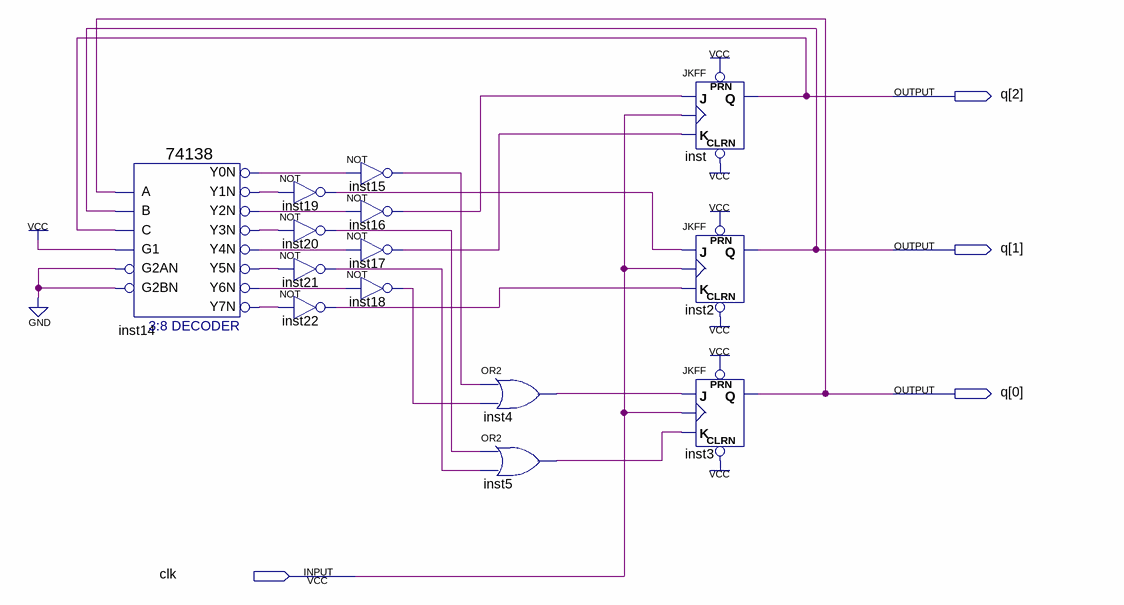
[diagram p0: schematic sheet]
// Quartus schematic seq_decoder.bdf as structural Verilog: 14 symbols, 4 pins
module seq_decoder (
  input  clk,
  output [2:0] q
);

  wire inst4_out, inst5_out, inst14_y0n, inst14_y1n, inst14_y2n, inst14_y3n, inst14_y4n, inst14_y5n,
       inst14_y6n, inst14_y7n, inst15_out, inst16_out, inst17_out, inst18_out, inst19_out, inst20_out,
       inst21_out, inst22_out;

  \74138  inst14 (
    .A(q[0]), .B(q[1]), .G1(1'b1), .C(q[2]), .G2AN(1'b0), .G2BN(1'b0), .Y0N(inst14_y0n), .Y1N(inst14_y1n),
    .Y2N(inst14_y2n), .Y3N(inst14_y3n), .Y4N(inst14_y4n), .Y5N(inst14_y5n), .Y6N(inst14_y6n), .Y7N(inst14_y7n));
  not inst19 (inst19_out, inst14_y1n);
  not inst20 (inst20_out, inst14_y3n);
  not inst21 (inst21_out, inst14_y5n);
  not inst22 (inst22_out, inst14_y7n);
  not inst15 (inst15_out, inst14_y0n);
  not inst16 (inst16_out, inst14_y2n);
  not inst17 (inst17_out, inst14_y4n);
  not inst18 (inst18_out, inst14_y6n);
  or inst4 (inst4_out, inst15_out, inst18_out);
  or inst5 (inst5_out, inst20_out, inst21_out);
  JKFF inst (.PRN(1'b1), .CLRN(1'b1), .K(inst17_out), .J(inst16_out), .CLK(clk), .Q(q[2]));
  JKFF inst2 (.PRN(1'b1), .CLRN(1'b1), .K(inst22_out), .J(inst19_out), .CLK(clk), .Q(q[1]));
  JKFF inst3 (.PRN(1'b1), .CLRN(1'b1), .K(inst5_out), .J(inst4_out), .CLK(clk), .Q(q[0]));
endmodule
